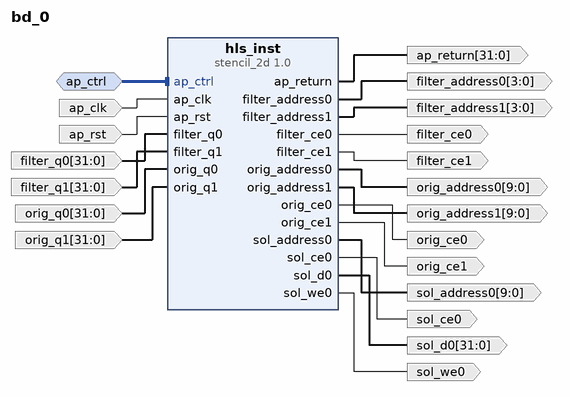
[diagram p0: block diagram of the top level]
# Vivado block design bd_0, xck24-ubva530-2LV-c, Vivado 2022.2
create_bd_design bd_0

create_bd_intf_port -mode Slave -vlnv xilinx.com:interface:acc_handshake_rtl:1.0 ap_ctrl
create_bd_port -dir I -type clk ap_clk
set_property -dict {CONFIG.FREQ_HZ 200000000.0} [get_bd_ports ap_clk]
create_bd_port -dir O -from 31 -to 0 -type data ap_return
create_bd_port -dir I -type rst ap_rst
set_property -dict {CONFIG.POLARITY ACTIVE_HIGH} [get_bd_ports ap_rst]
create_bd_port -dir O -from 3 -to 0 -type data filter_address0
create_bd_port -dir O -from 3 -to 0 -type data filter_address1
create_bd_port -dir O filter_ce0
create_bd_port -dir O filter_ce1
create_bd_port -dir I -from 31 -to 0 -type data filter_q0
create_bd_port -dir I -from 31 -to 0 -type data filter_q1
create_bd_port -dir O -from 9 -to 0 -type data orig_address0
create_bd_port -dir O -from 9 -to 0 -type data orig_address1
create_bd_port -dir O orig_ce0
create_bd_port -dir O orig_ce1
create_bd_port -dir I -from 31 -to 0 -type data orig_q0
create_bd_port -dir I -from 31 -to 0 -type data orig_q1
create_bd_port -dir O -from 9 -to 0 -type data sol_address0
create_bd_port -dir O sol_ce0
create_bd_port -dir O -from 31 -to 0 -type data sol_d0
create_bd_port -dir O sol_we0

create_bd_cell -type ip -vlnv xilinx.com:hls:stencil_2d:1.0 hls_inst

# ---- connections ----

connect_bd_intf_net -intf_net ap_ctrl_0_1 [get_bd_intf_ports ap_ctrl] [get_bd_intf_pins hls_inst/ap_ctrl]
connect_bd_net -net ap_clk_0_1 [get_bd_ports ap_clk] [get_bd_pins hls_inst/ap_clk]
connect_bd_net -net ap_rst_0_1 [get_bd_ports ap_rst] [get_bd_pins hls_inst/ap_rst]
connect_bd_net -net filter_q0_0_1 [get_bd_ports filter_q0] [get_bd_pins hls_inst/filter_q0]
connect_bd_net -net filter_q1_0_1 [get_bd_ports filter_q1] [get_bd_pins hls_inst/filter_q1]
connect_bd_net [get_bd_pins hls_inst/ap_return] [get_bd_ports ap_return]
connect_bd_net [get_bd_pins hls_inst/filter_address0] [get_bd_ports filter_address0]
connect_bd_net [get_bd_pins hls_inst/filter_address1] [get_bd_ports filter_address1]
connect_bd_net [get_bd_pins hls_inst/filter_ce0] [get_bd_ports filter_ce0]
connect_bd_net [get_bd_pins hls_inst/filter_ce1] [get_bd_ports filter_ce1]
connect_bd_net [get_bd_pins hls_inst/orig_address0] [get_bd_ports orig_address0]
connect_bd_net [get_bd_pins hls_inst/orig_address1] [get_bd_ports orig_address1]
connect_bd_net [get_bd_pins hls_inst/orig_ce0] [get_bd_ports orig_ce0]
connect_bd_net [get_bd_pins hls_inst/orig_ce1] [get_bd_ports orig_ce1]
connect_bd_net [get_bd_pins hls_inst/sol_address0] [get_bd_ports sol_address0]
connect_bd_net [get_bd_pins hls_inst/sol_ce0] [get_bd_ports sol_ce0]
connect_bd_net [get_bd_pins hls_inst/sol_d0] [get_bd_ports sol_d0]
connect_bd_net [get_bd_pins hls_inst/sol_we0] [get_bd_ports sol_we0]
connect_bd_net -net orig_q0_0_1 [get_bd_ports orig_q0] [get_bd_pins hls_inst/orig_q0]
connect_bd_net -net orig_q1_0_1 [get_bd_ports orig_q1] [get_bd_pins hls_inst/orig_q1]

validate_bd_design
save_bd_design
